# Altium schematic sheet Logica_ADC.SchDoc: CSN Detector V4_2
size A4; CheckedBy: RCP; Author: RCP; DrawnBy: RCP; Address1: LIM-HGGM; Address3: RCP; DocumentNumber: 1; Revision: 1; SheetNumber: 2; SheetTotal: 2; PageSetup: Record=PageOptions|CenterHorizontal=True|CenterVertical=True|PrintScale=0.97|XCorrection=1.00|YCorrection=1.00|PrintKind=0|BorderSize=5000000|LeftOffset=0|BottomOffset=0|Orientation=2|PaperLength=1000|PaperWidth=1000|Scale=100|PaperSource=7|PrintQuality=-4|MediaType=1|DitherType=10|PaperKind=A4|PrintScaleMode=1
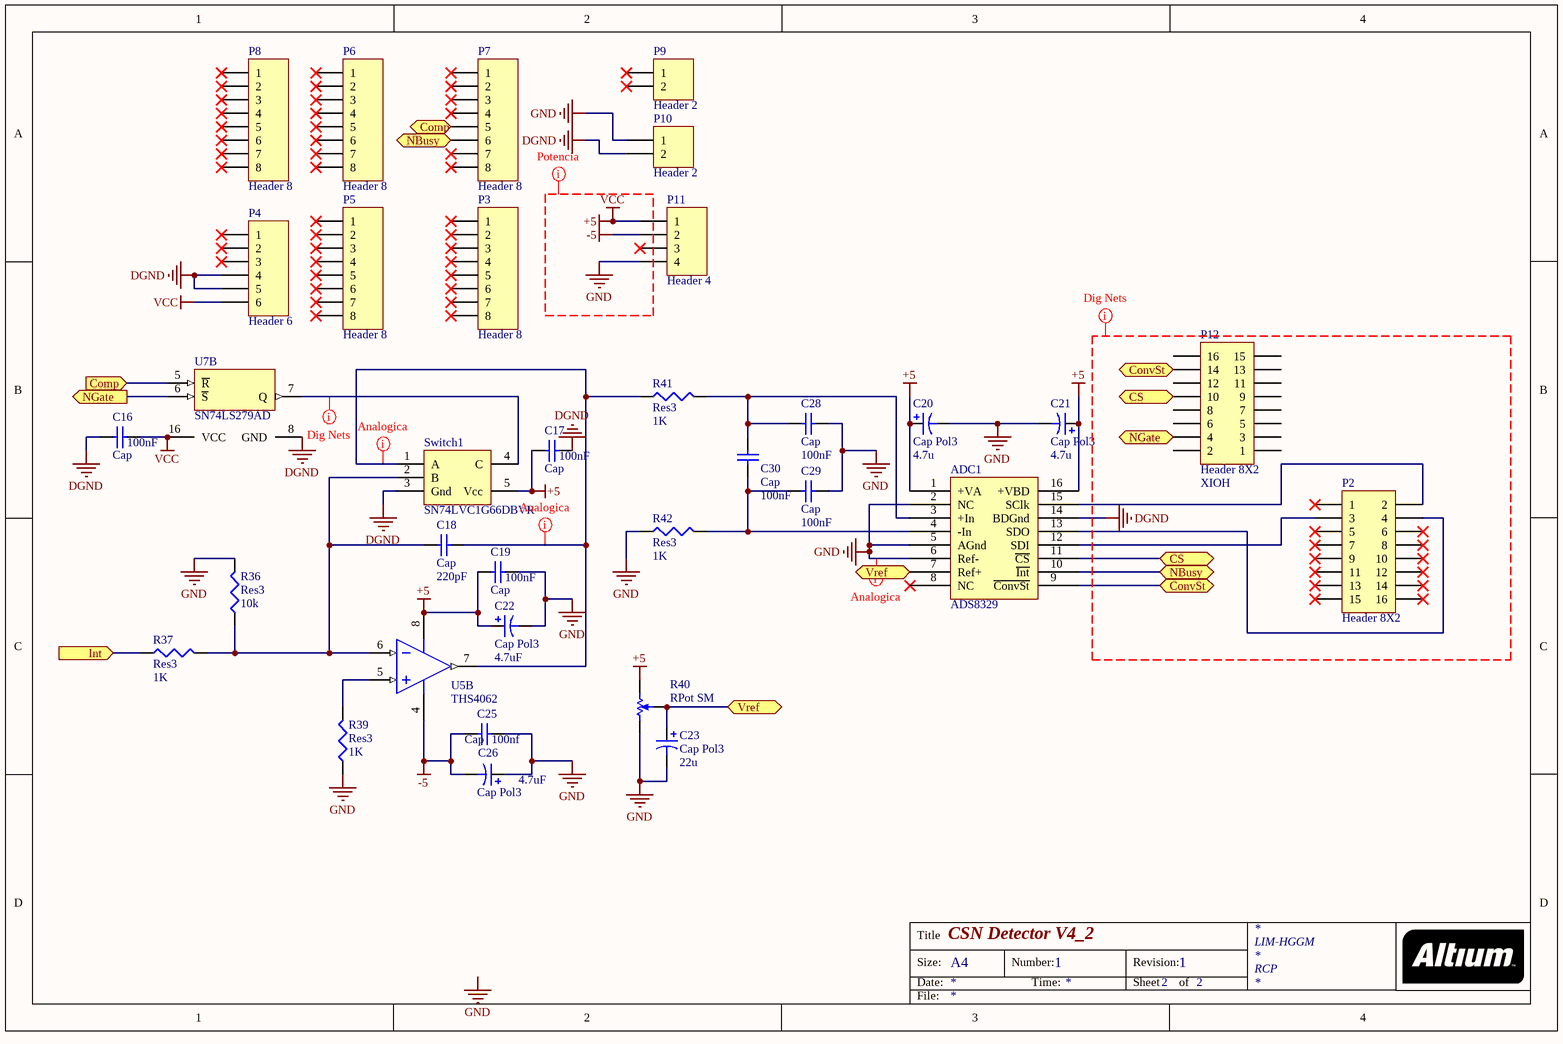
[diagram p0: Logica_ADC.SchDoc]

## Parts
ADC1  ADS8329  [PW-R-PDSO-G16]
C16  Cap  value 100nF  [6-0805_N]
C17  Cap  value 100nF  [6-0805_N]
C18  Cap  value 220pF  [6-0805_N]
C19  Cap  value 100nF  [6-0805_N]
C20  Cap Pol3  value 4.7u  [6-0805_N]
C21  Cap Pol3  value 4.7u  [6-0805_N]
C22  Cap Pol3  value 4.7uF  [6-0805_N]
C23  Cap Pol3  value 22u  [6-0805_N]
C25  Cap  value 100nf  [6-0805_N]
C26  Cap Pol3  value 4.7uF  [6-0805_N]
C28  Cap  value 100nF  [6-0805_N]
C29  Cap  value 100nF  [6-0805_N]
C30  Cap  value 100nF  [6-0805_N]
P2  Header 8X2  [HDR2X8]
P3  Header 8  [HDR1X8]
P4  Header 6  [HDR1X6]
P5  Header 8  [HDR1X8]
P6  Header 8  [HDR1X8]
P7  Header 8  [HDR1X8]
P8  Header 8  [HDR1X8]
P9  Header 2  [HDR1X2]
P10  Header 2  [HDR1X2]
P11  Header 4  [HDR1X4]
P12  Header 8X2  Con_Arduino: XIOH  [HDR2X8]
R36  Res3  value 10k  [6-0805_N]
R37  Res3  value 1K  [6-0805_N]
R39  Res3  value 1K  [6-0805_N]
R40  RPot SM  [POT4MM-2]
R41  Res3  value 1K  [6-0805_N]
R42  Res3  value 1K  [6-0805_N]
Switch1  SN74LVC1G66DBVR  [SOT23-5_N]
U5  THS4062  [S8_N]  (part B of 2)
U7  SN74LS279AD  [D016_N]  (part B of 4)

## Ports
Comp (in), Comp (out), ConvSt, CS, Int (in), NBusy, NGate (out), Vref

## Nets
+5: ADC1.1(+VA) ADC1.16(+VBD) C16.1 C17.2 C19.2 C20.1 C21.1 C22.1 P4.6 P11.1 R40.CW(+) Switch1.5(Vcc) U5.8(V+) U7.16(VCC)  [also labelled VCC]
-5: C25.1 C26.2 P11.2 U5.4(V-)
DGND: ADC1.2(NC) ADC1.5(AGnd) ADC1.6(Ref-) ADC1.14(BDGnd) C16.2 C17.1 C19.1 C20.2 C21.2 C22.2 C23.2 C25.2 C26.1 C28.1 C29.1 P4.4 P4.5 P10.1 P10.2 P11.4 R36.2 R39.1 R40.CCW(-) R42.1 Switch1.3(Gnd) U7.8(GND)  [also labelled GND]
Comp: P7.5 U7.5(~{R}) ; port Comp
ConvSt: ADC1.9(~{ConvSt}) P12.14 ; port ConvSt
CS: ADC1.11(~{CS}) P12.10 ; port CS
Int: R37.1 ; port Int
NBusy: ADC1.10(~{Int}) P7.6 ; port NBusy
NGate: P12.4 U7.6(~{S}) ; port NGate
Vref: ADC1.7(Ref+) C23.1 R40.W ; port Vref
NetADC1_3: ADC1.3(+In) C28.2 C30.2 R41.2
NetADC1_4: ADC1.4(-In) C29.2 C30.1 R42.2
NetADC1_12: ADC1.12(SDI) P2.3
NetADC1_13: ADC1.13(SDO) P2.4
NetADC1_15: ADC1.15(SClk) P2.2
NetC18_1: C18.1 R36.1 R37.2 Switch1.2(B) U5.6(IN-)
NetC18_2: C18.2 R41.1 Switch1.1(A) U5.7(OUT)
NetR39_2: R39.2 U5.5(IN+)
NetSwitch1_4: Switch1.4(C) U7.7(Q)

Not connected (* = marked no-connect by the designer): ADC1 8(NC)*; P2 1* 5* 6* 7* 8* 9* 10* 11* 12* 13* 14* 15* 16*; P3 1* 2* 3* 4* 5* 6* 7* 8*; P4 1* 2* 3*; P5 1* 2* 3* 4* 5* 6* 7* 8*; P6 1* 2* 3* 4* 5* 6* 7* 8*; P7 1* 2* 3* 4* 7* 8*; P8 1* 2* 3* 4* 5* 6* 7* 8*; P9 1* 2*; P11 3*; P12 1 2 3 5 6 7 8 9 11 12 13 15 16

## Layout directives
net class digital: DGND, NetSwitch1_4
net class potencia: +5, -5, GND, VCC
net class analog: DGND, NetC18_2

## Notes on the sheet
- Labels drawn without touching a wire or pin: GND
- Title
- Size:
- Date:
- A4
- Number:
- Time:
- Revision:
- Sheet
- of
- File:

## Library data of the parts
C16-C19 C25 C28-C30 = Cap: Capacitor; Published: 8-Jun-2000; LatestRevisionDate: 17-Jul-2002; LatestRevisionNote: Re-released for DXP Platform.; PackageReference: RAD-0.3; Publisher: Altium Limited; PackageDescription: Radial Cap, Thru-Hole; 2 Leads; 0.3 in Pin Spacing
C20-C23 C26 = Cap Pol3: Polarized Capacitor (Surface Mount); Published: 8-Jun-2000; LatestRevisionDate: 29-May-2009; LatestRevisionNote: IPC-7351 Footprint Added.; PackageReference: C0805; Publisher: Altium Limited; PackageDescription: Chip Capacitor
P2 P12 = Header 8X2: Header, 8-Pin, Dual row; LatestRevisionDate: 17-Jul-2002; LatestRevisionNote: Re-released for DXP Platform.; Publisher: Altium Limited
P3 P5-P8 = Header 8: Header, 8-Pin; LatestRevisionDate: 17-Jul-2002; LatestRevisionNote: Re-released for DXP Platform.; Publisher: Altium Limited
P4 = Header 6: Header, 6-Pin; LatestRevisionDate: 17-Jul-2002; LatestRevisionNote: Re-released for DXP Platform.; Publisher: Altium Limited
P9 P10 = Header 2: Header, 2-Pin; LatestRevisionDate: 17-Jul-2002; LatestRevisionNote: Re-released for DXP Platform.; Publisher: Altium Limited
P11 = Header 4: Header, 4-Pin; LatestRevisionDate: 17-Jul-2002; LatestRevisionNote: Re-released for DXP Platform.; Publisher: Altium Limited
R36 R37 R39 R41 R42 = Res3: Resistor; Published: 8-Jun-2000; LatestRevisionDate: 29-May-2009; LatestRevisionNote: IPC-7351 Footprint Added.; PackageReference: J1-0603; Publisher: Altium Limited; PackageDescription: Chip Resistor
R40 = RPot SM: Square Trimming Potentiometer; Published: 17-Dec-2003; DatasheetVersion: Oct-2003; PackageReference: POT4MM-2; Publisher: Altium Limited; PackageDescription: Square Trimming Potentiometer; ComponentLink1Description: Manufacturer Link; ComponentLink1URL: http://bourns.com/2/search.html
U5 = LT1253CS8: Low Cost Dual Video Amplifier; Note: 1003; Published: 8-Jun-2000; LatestRevisionDate: 13-Apr-2006; LatestRevisionNote: IPC-7351 Footprint Added.; DatasheetVersion: 1996; PackageReference: S8; Publisher: Altium Limited; PackageDescription: 8-Pin Small Outline Integrated Circuit 1.27 mm Pitch; Code_JEDEC: MS-012-AA; Code_IPC: SOIC127P600-8; ComponentLink1Description: Manufacturer Link; ComponentLink1URL: http://www.linear.com/; ComponentLink2Description: Datasheet; ComponentLink2URL: http://www.linear.com/pc/downloadDocument.do?navId=H0,C1,C1154,C1009,C1022,P1423,D1129
U7 = SN74LS279AD: Quadruple S-R Latches; Published: 8-Jun-2000; LatestRevisionDate: 13-Apr-2006; LatestRevisionNote: IPC-7351 Footprint Added.; DatasheetVersion: Mar-1988; PackageVersion: Jan-1998; PackageReference: D016; Publisher: Altium Limited; PackageDescription: 16-Pin Small Outline Integrated Circuit 1.27 mm Pitch; Code_IPC: SOIC127P600-16; ComponentLink1Description: Manufacturer Link; ComponentLink1URL: http://www.ti.com/; ComponentLink2Description: Datasheet; ComponentLink2URL: http://www-s.ti.com/sc/ds/sn54279.pdf